# EAGLE design RL78G10_E1 (EAGLE 9.6.2)
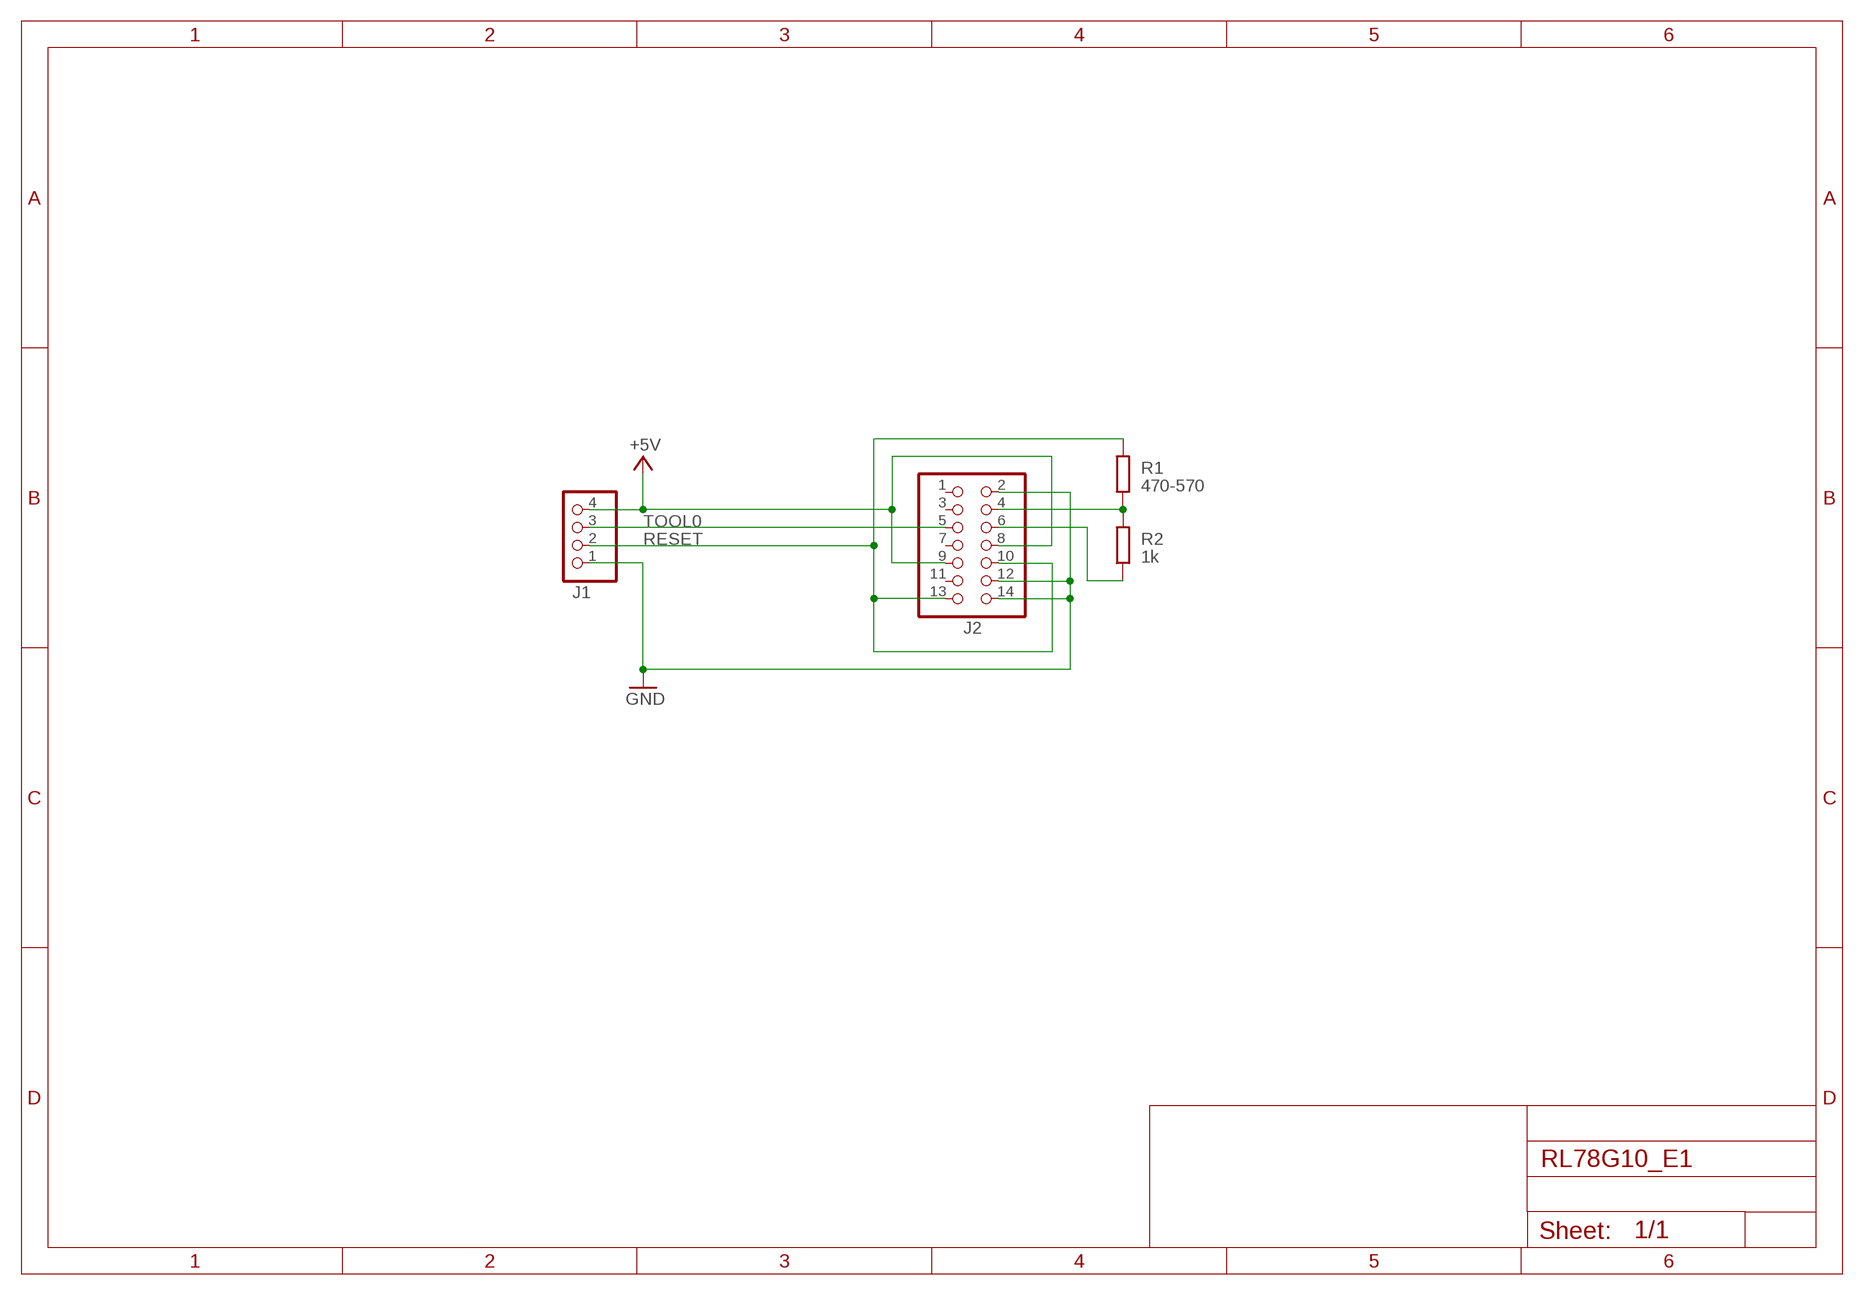
[diagram p0: schematic, sheet 1]

## Parts
J1  PINHD_1X4  [PINHD_1X04]
J2  PINHD_2X07  [PINHD_2X07]
R1  470-570  R-EU_R0603  [R0603]
R2  1k  R-EU_R0603  [R0603]

## Nets
+5V: J1.4 J2.8 J2.9
GND: J1.1 J2.2 J2.12 J2.14
P4: J2.4 R1.1 R2.2
P6: J2.6 R2.1
RESET: J1.2 J2.10 J2.13 R1.2
TOOL0: J1.3 J2.5
Unconnected: J2.1 J2.3 J2.7 J2.11

## Library data of the parts
J1 = MyLib:PINHD_1X4: PIN HEADER
J2 = MyLib:PINHD_2X07
R1 R2 = rcl:R-EU_: RESISTOR, European symbol

## Board
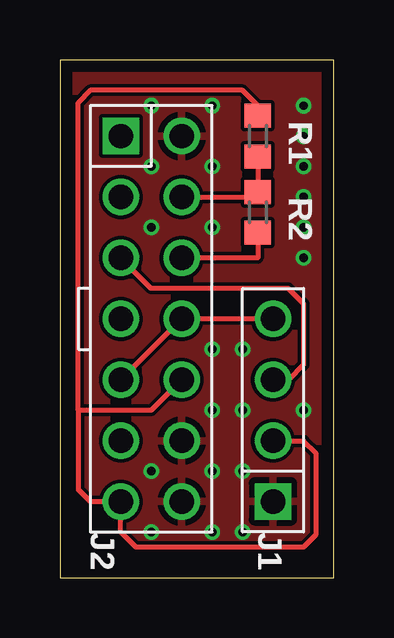
[diagram p1: board, top side]
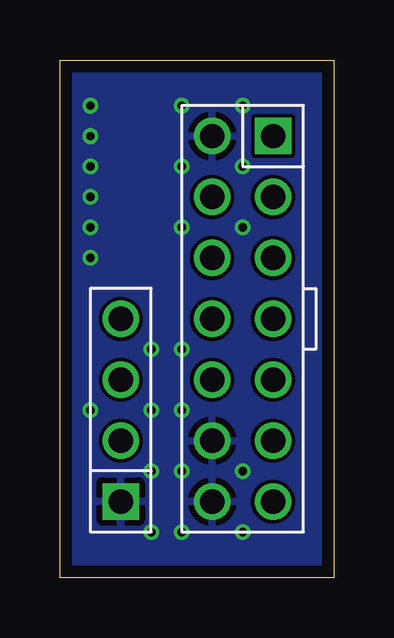
[diagram p2: board, bottom side, seen from below]

Size 11.43 x 21.59 mm. Coordinates in mm from the lower left corner, seen from the top.
Outline: 0,0 11.43,0 11.43,21.59 0,21.59 0,0
Copper layers (1*16): Top 0.035mm / dielectric 1.2mm / Bottom 0.035mm
Design rules "pcbgogo_2layer": minimum track width 6mil, minimum drill 0.3mm, track to track 6mil, track to pad 6mil, pad to pad 6mil, via to via 6mil, smd to smd 6mil, copper to edge 0.5mm, drill to drill 0.3mm, minimum pad ring 0.15mm, minimum via ring 0.15mm, stop-mask expansion 4mil, vias tented up to drill 0.35mm, thermal gap 10mil

### Footprints (pad centres in the part's own frame; a part is rotated, then mirrored left to right if it is on the bottom)
PINHD_1X04 = drill 1.016 square: 1 -3.81,0 | drill 1.016: 2 -1.27,0; 3 1.27,0; 4 3.81,0
PINHD_2X07 = drill 1.016 square: 1 -7.62,0 | drill 1.016: 2 -7.62,2.54; 3 -5.08,0; 4 -5.08,2.54; 5 -2.54,0; 6 -2.54,2.54; 7 0,0; 8 0,2.54; 9 2.54,0; 10 2.54,2.54; 11 5.08,0; 12 5.08,2.54; 13 7.62,0; 14 7.62,2.54
R0603 = smd 1 x 1.1: 1 -0.85,0; 2 0.85,0

### Placement (x,y rotation side)
J1  8.89,6.99 90 top
J2  2.54,10.79 270 top
R1  8.26,18.41 90 top
R2  8.26,15.24 90 top

### Tracks (layer width: path | path; a pad name or v marks a point on that pad's centre or on a via)
+5V
  Top 0.203: J1.4 J2.8 J2.9
GND  (via drill 0.35)
  other vias: 6.35,17.14 3.81,17.14 3.81,14.61 3.81,4.45 6.35,4.45 6.35,6.99 6.35,9.53 7.62,9.53 7.62,6.99 7.62,4.45 7.62,1.91 6.35,1.91 3.81,1.91 10.16,6.99 6.35,14.61 6.35,19.68 3.81,19.68 10.16,17.14 10.16,15.88 10.16,18.41 10.16,19.68 10.16,14.61 10.16,13.34
  pour Top (rank 6): 0,0 0,21.59 11.43,21.59 11.43,0
  pour Bottom (rank 6): 0,0 0,21.59 11.43,21.59 11.43,0
P4
  Top 0.203: R1.1 R2.2 8.26,15.88 J2.4
P6
  Top 0.203: R2.1 8.26,13.34 J2.6
RESET
  Top 0.203: 0.76,6.99 0.76,3.68 1.27,3.17 J2.13 2.54,1.91 3.17,1.27 10.16,1.27 10.67,1.78 10.67,5.21 10.16,5.71 J1.2 | J2.10 3.81,6.99 0.76,6.99 | 0.76,6.99 0.76,19.81 1.27,20.32 7.62,20.32 8.26,19.68 R1.2
TOOL0
  Top 0.203: J2.5 3.81,12.06 9.53,12.06 10.16,11.43 10.16,8.89 9.53,8.26 J1.3